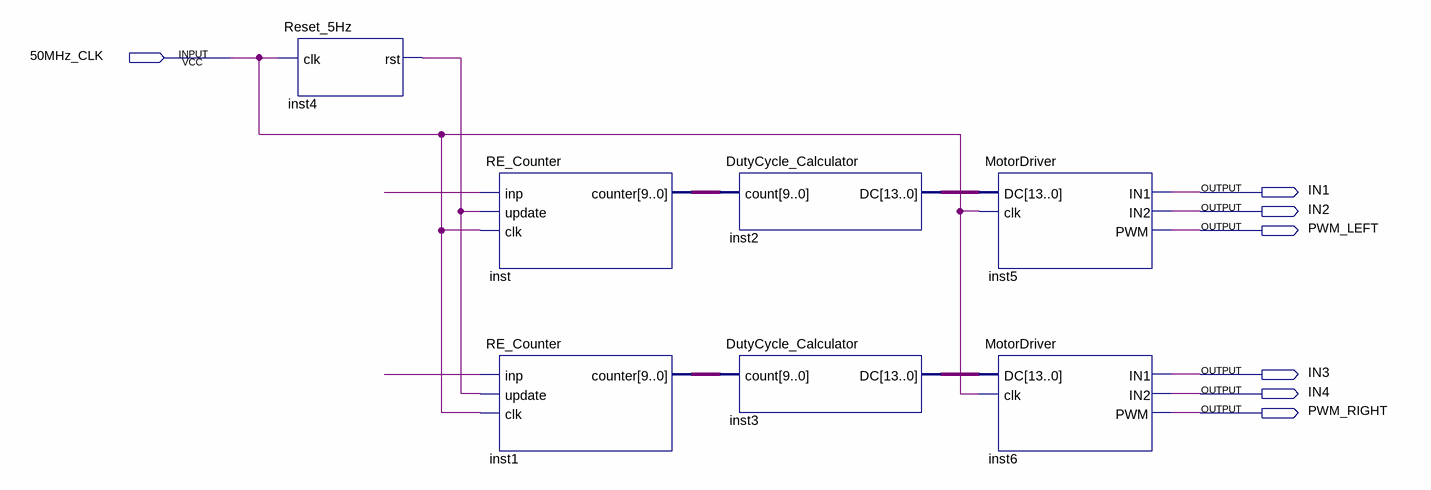
[diagram p0: schematic sheet]
// Quartus schematic SNN_with_Driver_V2.bdf as structural Verilog: 7 symbols, 7 pins
module SNN_with_Driver_V2 (
  input  \50MHz_CLK ,
  output IN1,
  output IN2,
  output PWM_LEFT,
  output IN3,
  output IN4,
  output PWM_RIGHT
);

  wire inst4_rst, undriven, undriven_2;
  wire [9:0] inst1_counter, inst_counter;
  wire [13:0] inst2_dc, inst3_dc;

  Reset_5Hz inst4 (.clk(\50MHz_CLK ), .rst(inst4_rst));
  RE_Counter inst (.inp(undriven), .update(inst4_rst), .clk(\50MHz_CLK ), .counter(inst_counter));
  RE_Counter inst1 (.inp(undriven_2), .update(inst4_rst), .clk(\50MHz_CLK ), .counter(inst1_counter));
  DutyCycle_Calculator inst2 (.count(inst_counter), .DC(inst2_dc));
  DutyCycle_Calculator inst3 (.count(inst1_counter), .DC(inst3_dc));
  MotorDriver inst5 (.DC(inst2_dc), .clk(\50MHz_CLK ), .IN1(IN1), .IN2(IN2), .PWM(PWM_LEFT));
  MotorDriver inst6 (.DC(inst3_dc), .clk(\50MHz_CLK ), .IN1(IN3), .IN2(IN4), .PWM(PWM_RIGHT));
endmodule
